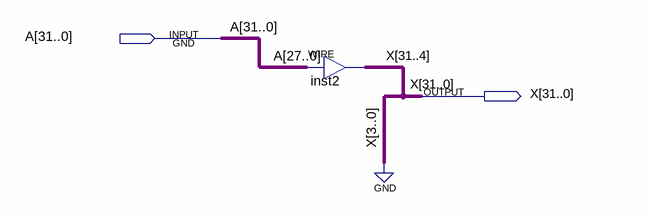
[diagram p0: schematic sheet]
// Quartus schematic shft4l32.bdf as structural Verilog: 1 symbols, 2 pins
module shft4l32 (
  input  [31:0] A,
  output [31:0] X
);

  assign X[31:4] = A[27:0];  // WIRE inst2

  assign X[3:0] = 4'b0000;
endmodule
